# EAGLE schematic LC adapter (EAGLE 6.5.0)
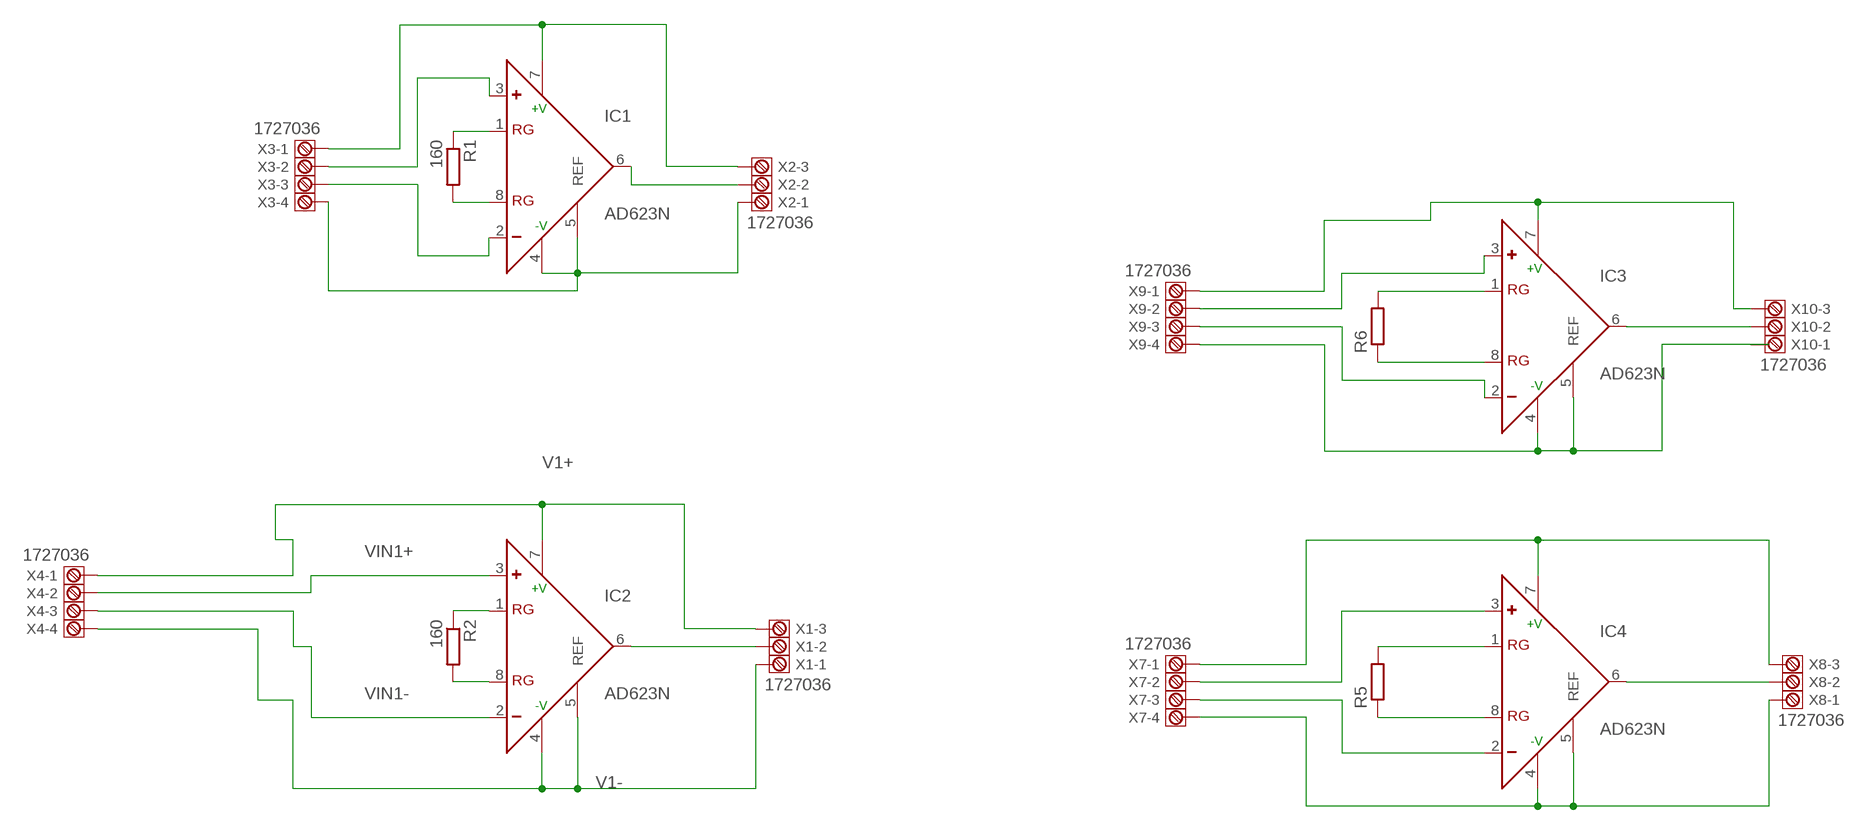
[diagram p0: schematic, sheet 1]

## Parts
IC1  AD623N  [DIL08]
IC2  AD623N  [DIL08]
IC3  AD623N  [DIL08]
IC4  AD623N  [DIL08]
R1  160  R-EU_0204/7  [0204/7]
R2  160  R-EU_0204/7  [0204/7]
R5  R-EU_0204/7  [0204/7]
R6  R-EU_0204/7  [0204/7]
X1  1727036  [1727036]
X2  1727036  [1727036]
X3  1727036  [1727036]
X4  1727036  [1727036]
X7  1727036  [1727036]
X8  1727036  [1727036]
X9  1727036  [1727036]
X10  1727036  [1727036]

## Nets
N$1: IC1.1(RG) R1.1
N$2: IC1.8(RG) R1.2
N$3: IC2.1(RG) R2.1
N$4: IC2.8(RG) R2.2
N$5: IC1.7(+V) X2.3 X3.1
N$6: IC1.6(OUT) X2.2
N$7: IC1.4(-V) IC1.5(REF) X2.1 X3.4
N$8: IC3.1(RG) R6.2
N$9: IC1.3(+) X3.2
N$10: IC1.2(-) X3.3
N$11: IC3.8(RG) R6.1
N$12: IC2.6(OUT) X1.2
N$13: IC3.3(+) X9.2
N$14: IC3.2(-) X9.3
N$15: IC3.7(+V) X9.1 X10.3
N$16: IC3.4(-V) IC3.5(REF) X9.4
N$17: IC4.1(RG) R5.2
N$18: IC4.8(RG) R5.1
N$19: IC3.6(OUT) X10.2
N$20: IC4.6(OUT) X8.2
N$21: IC4.7(+V) X7.1 X8.3
N$22: IC4.4(-V) IC4.5(REF) X7.4 X8.1
N$23: IC4.2(-) X7.3
N$24: IC4.3(+) X7.2
V1+: IC2.7(+V) X1.3 X4.1
V1-: IC2.4(-V) IC2.5(REF) X1.1 X4.4
VIN1+: IC2.3(+) X4.2
VIN1-: IC2.2(-) X4.3
Unconnected: X1.4 X2.4 X8.4 X10.1 X10.4

## Library data of the parts
IC1-IC4 = pmendes:AD623: Single-Supply, Rail-to-Rail, Low Cost Instrumentation Amplifier Source: http://www.analog.com/static/imported-files/data_sheets/AD623.pdf; MF: ALTERA CORPORATION; MPN: AD623ANZ; OC_FARNELL: 9603700; OC_NEWARK: 59K4402
R1 R2 R5 R6 = pmendes:R-EU_: RESISTOR, European symbol
X1-X4 X7-X10 = pmendes:1727036: MKDS 1/4-3,81 Source: http://eshop.phoenixcontact.de; MF: FARNELL; MPN: 1727036; OC_FARNELL: 3704592; OC_NEWARK: 71C4114